# Altium schematic sheet LPCB280 - TOP.SchDoc
size A3; Address1: Factory 10; Address2: 9-13 Dingley Avenue, Dandeong, VICTORIA 3175, AUSTRALIA; DocumentNumber: 1; Revision: 1; SheetNumber: 1; SheetTotal: 6; Lockie__PCB_SUB_ASSEMBLY: PCB Sub Component; Lockie__PCB_ASSEMBLY: PCB Assembly; Lockie__LDL: LPCB280; Lockie__PCB_DESCRIPTION: Gimbal Control Unit (GCU)
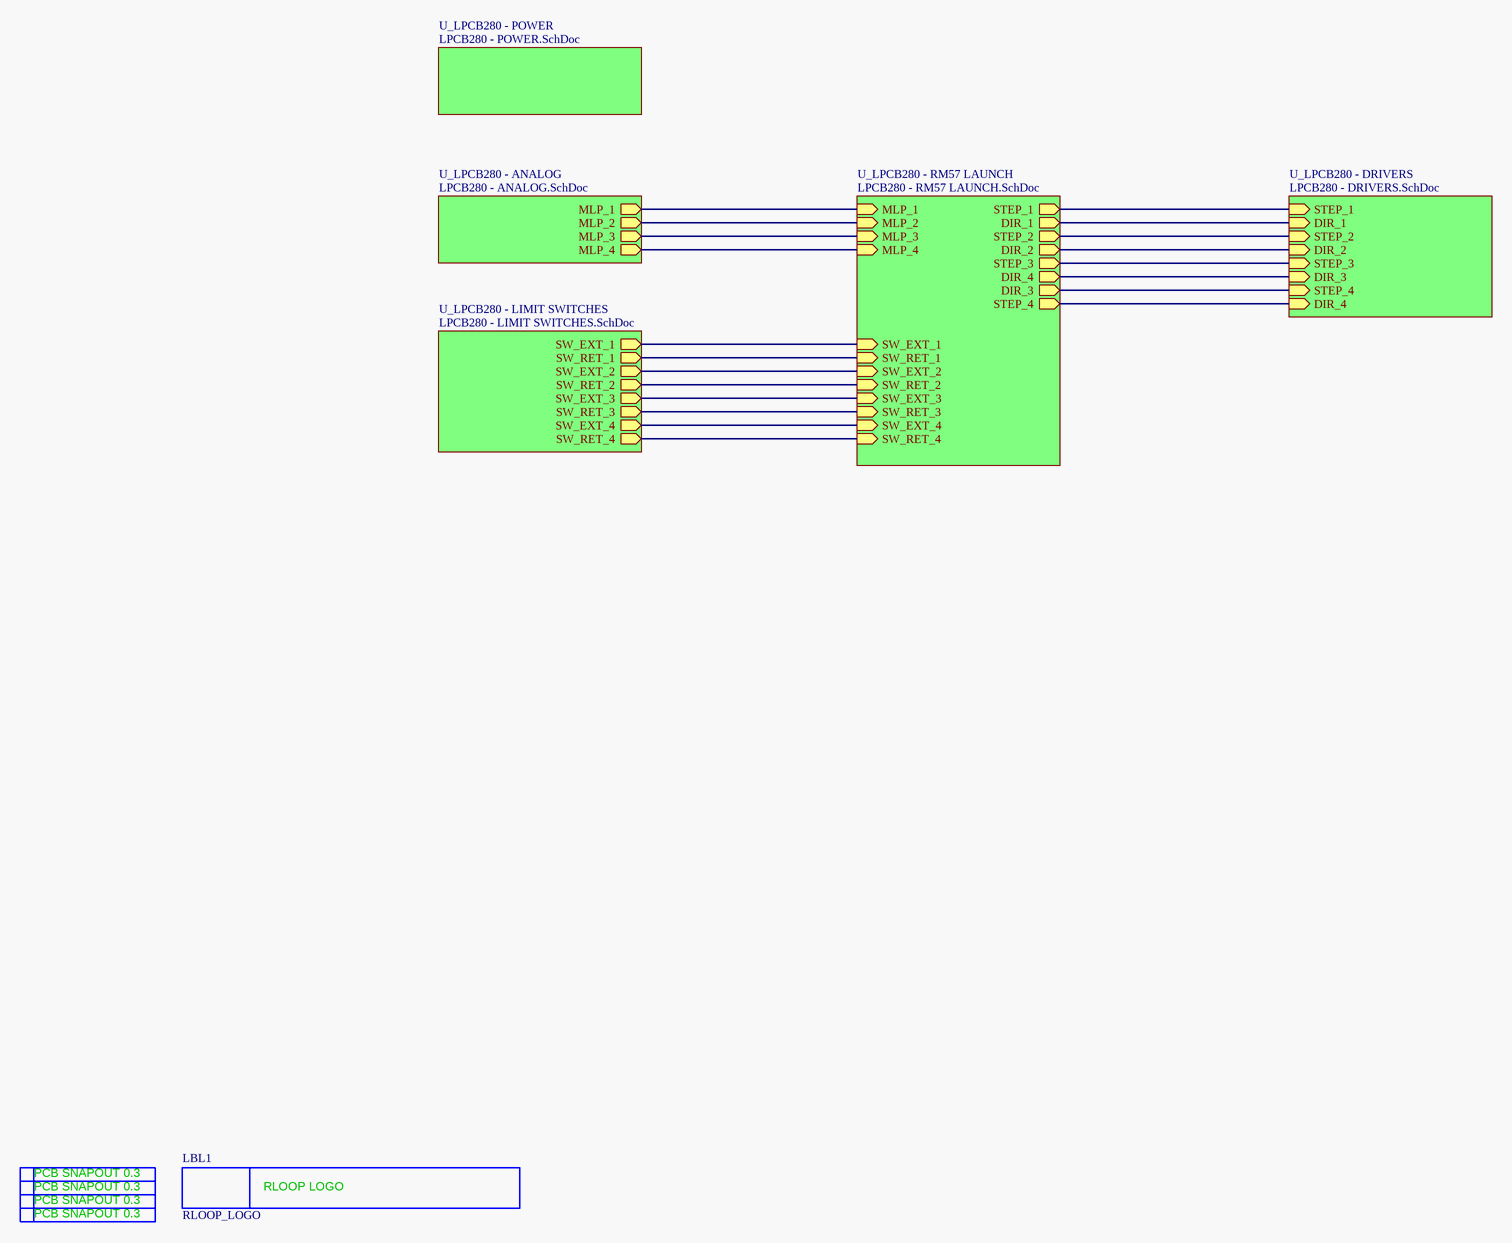
[diagram p0: LPCB280 - TOP.SchDoc]

## Parts
LBL1  RLOOP_LOGO  [RLOOP_LOGO]  (no BOM)
SN1  PCB_SNAPOUT_0.3MM  [PCB_SNAPOUT_0.3MM]  (value not drawn)  (no BOM)
SN2  PCB_SNAPOUT_0.3MM  [PCB_SNAPOUT_0.3MM]  (value not drawn)  (no BOM)
SN3  PCB_SNAPOUT_0.3MM  [PCB_SNAPOUT_0.3MM]  (value not drawn)  (no BOM)
SN4  PCB_SNAPOUT_0.3MM  [PCB_SNAPOUT_0.3MM]  (value not drawn)  (no BOM)

## Sub-sheets
U_LPCB280 - ANALOG = LPCB280 - ANALOG.SchDoc: MLP_1 (out), MLP_2 (out), MLP_3 (out), MLP_4 (out)
U_LPCB280 - DRIVERS = LPCB280 - DRIVERS.SchDoc: STEP_1 (in), DIR_1 (in), STEP_2 (in), DIR_2 (in), STEP_3 (in), DIR_3 (in), STEP_4 (in), DIR_4 (in)
U_LPCB280 - LIMIT SWITCHES = LPCB280 - LIMIT SWITCHES.SchDoc: SW_EXT_1 (out), SW_RET_1 (out), SW_EXT_2 (out), SW_RET_2 (out), SW_EXT_3 (out), SW_RET_3 (out), SW_EXT_4 (out), SW_RET_4 (out)
U_LPCB280 - POWER = LPCB280 - POWER.SchDoc: no entries
U_LPCB280 - RM57 LAUNCH = LPCB280 - RM57 LAUNCH.SchDoc: MLP_1 (in), MLP_2 (in), MLP_3 (in), MLP_4 (in), SW_EXT_1 (in), SW_RET_1 (in), SW_EXT_4 (in), SW_RET_4 (in), SW_EXT_3 (in), SW_RET_3 (in), SW_EXT_2 (in), SW_RET_2 (in), STEP_1 (out), DIR_1 (out), STEP_2 (out), DIR_2 (out), STEP_3 (out), DIR_4 (out), DIR_3 (out), STEP_4 (out)

## Nets
(unnamed): sheet U_LPCB280 - RM57 LAUNCH/MLP_1, sheet U_LPCB280 - ANALOG/MLP_1
(unnamed): sheet U_LPCB280 - RM57 LAUNCH/MLP_2, sheet U_LPCB280 - ANALOG/MLP_2
(unnamed): sheet U_LPCB280 - RM57 LAUNCH/MLP_3, sheet U_LPCB280 - ANALOG/MLP_3
(unnamed): sheet U_LPCB280 - RM57 LAUNCH/MLP_4, sheet U_LPCB280 - ANALOG/MLP_4
(unnamed): sheet U_LPCB280 - RM57 LAUNCH/SW_EXT_1, sheet U_LPCB280 - LIMIT SWITCHES/SW_EXT_1
(unnamed): sheet U_LPCB280 - RM57 LAUNCH/SW_RET_1, sheet U_LPCB280 - LIMIT SWITCHES/SW_RET_1
(unnamed): sheet U_LPCB280 - RM57 LAUNCH/SW_EXT_4, sheet U_LPCB280 - LIMIT SWITCHES/SW_EXT_4
(unnamed): sheet U_LPCB280 - RM57 LAUNCH/SW_RET_4, sheet U_LPCB280 - LIMIT SWITCHES/SW_RET_4
(unnamed): sheet U_LPCB280 - RM57 LAUNCH/SW_EXT_3, sheet U_LPCB280 - LIMIT SWITCHES/SW_EXT_3
(unnamed): sheet U_LPCB280 - RM57 LAUNCH/SW_RET_3, sheet U_LPCB280 - LIMIT SWITCHES/SW_RET_3
(unnamed): sheet U_LPCB280 - RM57 LAUNCH/SW_EXT_2, sheet U_LPCB280 - LIMIT SWITCHES/SW_EXT_2
(unnamed): sheet U_LPCB280 - RM57 LAUNCH/SW_RET_2, sheet U_LPCB280 - LIMIT SWITCHES/SW_RET_2
(unnamed): sheet U_LPCB280 - RM57 LAUNCH/STEP_1, sheet U_LPCB280 - DRIVERS/STEP_1
(unnamed): sheet U_LPCB280 - RM57 LAUNCH/DIR_1, sheet U_LPCB280 - DRIVERS/DIR_1
(unnamed): sheet U_LPCB280 - RM57 LAUNCH/STEP_2, sheet U_LPCB280 - DRIVERS/STEP_2
(unnamed): sheet U_LPCB280 - RM57 LAUNCH/DIR_2, sheet U_LPCB280 - DRIVERS/DIR_2
(unnamed): sheet U_LPCB280 - RM57 LAUNCH/STEP_3, sheet U_LPCB280 - DRIVERS/STEP_3
(unnamed): sheet U_LPCB280 - RM57 LAUNCH/DIR_4, sheet U_LPCB280 - DRIVERS/DIR_3
(unnamed): sheet U_LPCB280 - RM57 LAUNCH/DIR_3, sheet U_LPCB280 - DRIVERS/STEP_4
(unnamed): sheet U_LPCB280 - RM57 LAUNCH/STEP_4, sheet U_LPCB280 - DRIVERS/DIR_4

## Notes on the sheet
- PCB COMPONENT DESCRIPTION
- LDL NUMBER
- Assembly Details
- Size
- Drawing File Name
- Revision
- http://sil3.com.au
  ACN: 123 529 064
  Factory 10
  9-13 Dingley Avenue
  Dandenong, VICTORIA
  Australia
- Scale
- A3
- Sheet Details
- N.T.S
- Sheet:
- Of:
- (in symbol PCB_SNAPOUT_0.3MM) PCB SNAPOUT 0.3
- (in symbol RLOOP_LOGO) RLOOP LOGO

## Library data of the parts
LBL1 = RLOOP_LOGO: FMEDA__CHANNEL: DIAG; FMEDA__FUNCTION_IN_SYSTEM: *
SN1-SN4 = PCB_SNAPOUT_0.3MM: PCB Snapout + 0.3mm; FMEDA__CHANNEL: DIAG; FMEDA__FUNCTION_IN_SYSTEM: *